# Altium schematic sheet STM32F103C8T6 MCU.SchDoc
size A; SheetNumber: 10; SheetTotal: 19
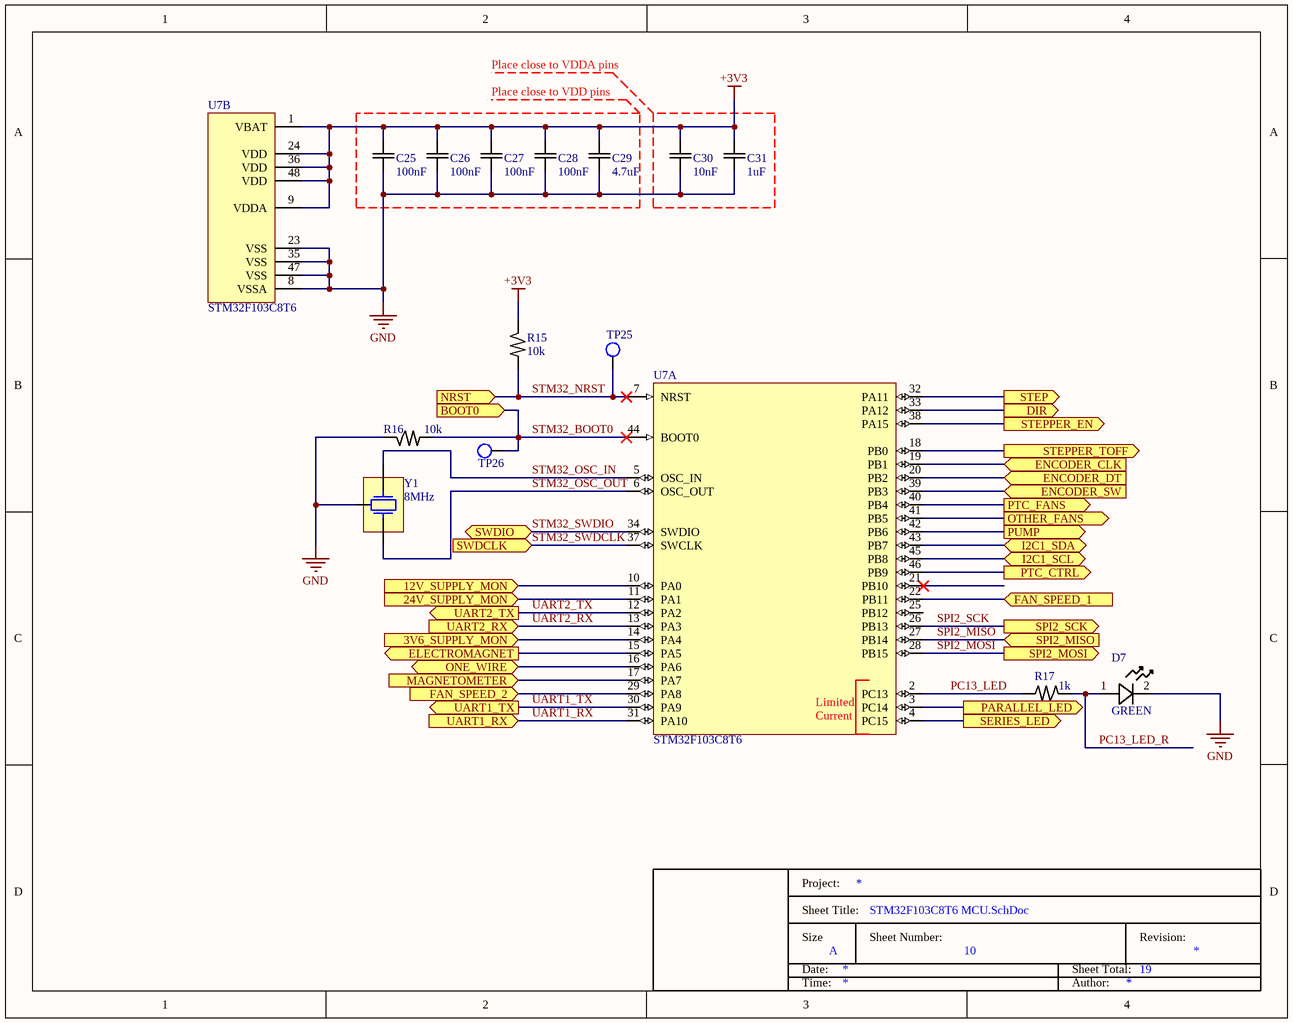
[diagram p0: STM32F103C8T6 MCU.SchDoc]

## Parts
C25  100nF  [C0603]
C26  100nF  [C0603]
C27  100nF  [C0603]
C28  100nF  [C0603]
C29  4.7uF  [C0603]
C30  10nF  [C0603]
C31  1uF  [C0603]
D7  GREEN  [LED0805 GREEN]
R15  10k  [R0603]
R16  10k  [R0603]
R17  1k  [R0603]
TP25  TestPoint  [TESTPOINT_SMD_1.27MM]  (value not drawn)  (no BOM)
TP26  TestPoint  [TESTPOINT_SMD_1.27MM]  (value not drawn)  (no BOM)
U7  STM32F103C8T6  [STM32-LQFP48]  (parts A,B of 2)
Y1  8MHz  [Resonator-SMD3213-3P]

## Blocks framed on the sheet
Place close to VDD pins: C25-C29

## Ports
3V6_SUPPLY_MON (in), 12V_SUPPLY_MON (in), 24V_SUPPLY_MON (in), BOOT0 (in), DIR (out), ELECTROMAGNET (out), ENCODER_CLK (in), ENCODER_DT (in), ENCODER_SW (in), FAN_SPEED_1 (in), FAN_SPEED_2 (in), I2C1_SCL (bidir), I2C1_SDA (bidir), MAGNETOMETER (in), NRST (in), ONE_WIRE (bidir), OTHER_FANS (out), PARALLEL_LED (out), PTC_CTRL (out), PTC_FANS (out), PUMP (out), SERIES_LED (out), SPI2_MISO (in), SPI2_MOSI (out), SPI2_SCK (out), STEP (out), STEPPER_EN (out), STEPPER_TOFF (out), SWDCLK (in), SWDIO (bidir), UART1_RX (in), UART1_TX (out), UART2_RX (in), UART2_TX (out)

## Nets
+3V3: C25.2 C26.2 C27.2 C28.2 C29.2 C30.1 C31.1 R15.2 U7.1(VBAT) U7.9(VDDA) U7.24(VDD) U7.36(VDD) U7.48(VDD)
GND: C25.1 C26.1 C27.1 C28.1 C29.1 C30.2 C31.2 D7.2 R16.2 U7.8(VSSA) U7.23(VSS) U7.35(VSS) U7.47(VSS) Y1.2
3V6_SUPPLY_MON: U7.14(PA4) ; port 3V6_SUPPLY_MON
12V_SUPPLY_MON: U7.10(PA0) ; port 12V_SUPPLY_MON
24V_SUPPLY_MON: U7.11(PA1) ; port 24V_SUPPLY_MON
DIR: U7.33(PA12) ; port DIR
ELECTROMAGNET: U7.15(PA5) ; port ELECTROMAGNET
ENCODER_CLK: U7.19(PB1) ; port ENCODER_CLK
ENCODER_DT: U7.20(PB2) ; port ENCODER_DT
ENCODER_SW: U7.39(PB3) ; port ENCODER_SW
FAN_SPEED_1: U7.22(PB11) ; port FAN_SPEED_1
FAN_SPEED_2: U7.29(PA8) ; port FAN_SPEED_2
I2C1_SCL: U7.45(PB8) ; port I2C1_SCL
I2C1_SDA: U7.43(PB7) ; port I2C1_SDA
MAGNETOMETER: U7.17(PA7) ; port MAGNETOMETER
ONE_WIRE: U7.16(PA6) ; port ONE_WIRE
OTHER_FANS: U7.41(PB5) ; port OTHER_FANS
PARALLEL_LED: U7.3(PC14) ; port PARALLEL_LED
PC13_LED: R17.1 U7.2(PC13)
PC13_LED_R: D7.1 R17.2
PTC_CTRL: U7.46(PB9) ; port PTC_CTRL
PTC_FANS: U7.40(PB4) ; port PTC_FANS
PUMP: U7.42(PB6) ; port PUMP
SERIES_LED: U7.4(PC15) ; port SERIES_LED
SPI2_MISO: U7.27(PB14) ; port SPI2_MISO
SPI2_MOSI: U7.28(PB15) ; port SPI2_MOSI
SPI2_SCK: U7.26(PB13) ; port SPI2_SCK
STEP: U7.32(PA11) ; port STEP
STEPPER_EN: U7.38(PA15) ; port STEPPER_EN
STEPPER_TOFF: U7.18(PB0) ; port STEPPER_TOFF
STM32_BOOT0: R16.1 TP26.1 U7.44(BOOT0) ; port BOOT0
STM32_NRST: R15.1 TP25.1 U7.7(NRST) ; port NRST
STM32_OSC_IN: U7.5(OSC_IN) Y1.1
STM32_OSC_OUT: U7.6(OSC_OUT) Y1.3
STM32_SWDCLK: U7.37(SWCLK) ; port SWDCLK
STM32_SWDIO: U7.34(SWDIO) ; port SWDIO
UART1_RX: U7.31(PA10) ; port UART1_RX
UART1_TX: U7.30(PA9) ; port UART1_TX
UART2_RX: U7.13(PA3) ; port UART2_RX
UART2_TX: U7.12(PA2) ; port UART2_TX

Not connected (* = marked no-connect by the designer): U7 21(PB10)* 25(PB12)

## Notes on the sheet
- Place close to VDDA pins
- Project:
- Sheet Title:
- Size
- Date:
- A
- Sheet Number:
- Sheet Total:
- Revision:
- Time:
- Author:
- (in symbol STM32F103C8T6, part A) Limited Current

## Library data of the parts
C25-C28 = Cap_cer: CAP CER 100nF 50V X7R 0603; MF: HRE; MP: CGA0603X7R104K500JT; ComponentLink1Description: Datasheet; ComponentLink1URL: https://www.lcsc.com/datasheet/C6119867.pdf; ComponentLink2Description: Supplier1; ComponentLink2URL: https://www.lcsc.com/product-detail/C6119867.html
C29 = Cap_cer: 10V 4.7uF X7R ±10% 0603 Ceramic Capacitors ROHS; MF: Chinocera; MP: HGC0603R7475K100NTHJ; ComponentLink1Description: Datasheet; ComponentLink1URL: *; ComponentLink2Description: Supplier1; ComponentLink2URL: https://www.lcsc.com/product-detail/C49333234.html?s_z=n_HGC0603R7475K100NTHJ
C30 = Cap_cer: CAP CER 10nF 50V X7R 0603; MF: HRE; MP: CGA0603X7R103M500JT; ComponentLink1Description: Datasheet; ComponentLink1URL: https://www.lcsc.com/datasheet/C36911427.pdf; ComponentLink2Description: Supplier1; ComponentLink2URL: https://www.lcsc.com/product-detail/C36911427.html
C31 = Cap_cer: 25V 1uF X7R ±10% 0603 Ceramic Capacitors ROHS; MF: Samsung Electro-Mechanics; MP: CL10B105KA8NNNC; ComponentLink1Description: Datasheet; ComponentLink1URL: https://www.lcsc.com/datasheet/C29936.pdf; ComponentLink2Description: Supplier1; ComponentLink2URL: https://www.lcsc.com/product-detail/C29936.html
D7 = LED: LED EMERALD GREEN WATER CLEAR 0805 SMD; MF: XINGLIGHT; MP: XL-TD2012UGC; ComponentLink1Description: Datasheet; ComponentLink1URL: https://www.lcsc.com/datasheet/C5349942.pdf; ComponentLink2Description: Supplier1; ComponentLink2URL: https://www.lcsc.com/product-detail/C5349942.html
R15 R16 = Res: RES 10kΩ ±1% 100mW 0603; MF: FOJAN; MP: FRC0603F1002TS; ComponentLink1Description: Datasheet; ComponentLink1URL: https://www.lcsc.com/datasheet/C2906982.pdf; ComponentLink2Description: Supplier1; ComponentLink2URL: https://www.lcsc.com/product-detail/C2906982.html
R17 = Res: RES 1kΩ ±5% 100mW 0603; MF: VO; MP: SCR0603J1K; ComponentLink1Description: Datasheet; ComponentLink1URL: https://www.lcsc.com/datasheet/C3017736.pdf; ComponentLink2Description: Supplier1; ComponentLink2URL: https://www.lcsc.com/product-detail/C3017736.html
U7 = STM32F103C8T6: ARM-M3 72MHz 128Kb Flash 20Kb SRAM LQFP-48(7x7) Microcontrollers ROHS; MF: STMicroelectronics; MP: STM32F103C8T6; ComponentLink1Description: Datasheet; ComponentLink1URL: https://www.st.com/resource/en/datasheet/stm32f103c8.pdf; ComponentLink2Description: Supplier1; ComponentLink2URL: https://www.lcsc.com/product-detail/C8734.html?s_z=n_STM32F103C8T6
Y1 = Resonator: 8MHz 10pF 40Ω SMD3213-3P Resonators ROHS; MF: muRata; MP: CSTNE8M00G520000R0; ComponentLink1Description: Datasheet; ComponentLink1URL: https://www.lcsc.com/datasheet/C907975.pdf; ComponentLink2Description: Supplier1; ComponentLink2URL: https://www.lcsc.com/product-detail/C907975.html